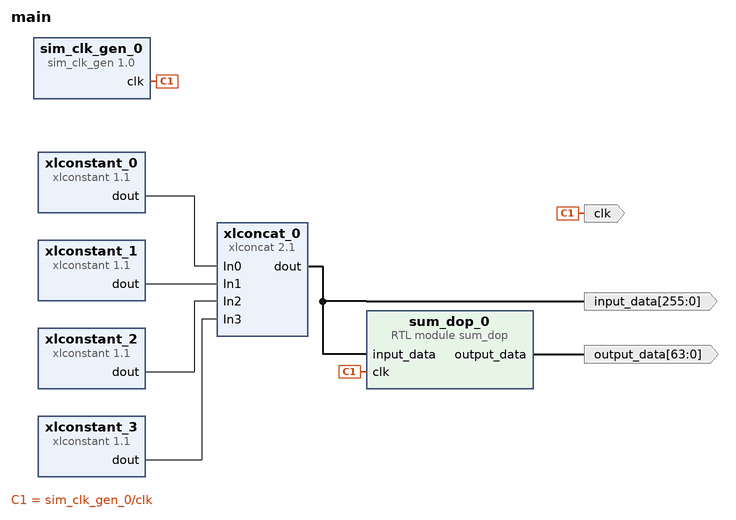
[diagram p0: block diagram of the top level]
# Vivado block design main, xczu48dr-fsvg1517-2-e-es1, Vivado 2020.2
create_bd_design main

create_bd_port -dir O -from 63 -to 0 output_data
create_bd_port -dir O clk
create_bd_port -dir O -from 255 -to 0 input_data

create_bd_cell -type module -reference sum_dop sum_dop_0
create_bd_cell -type ip -vlnv xilinx.com:ip:sim_clk_gen:1.0 sim_clk_gen_0
create_bd_cell -type ip -vlnv xilinx.com:ip:xlconcat:2.1 xlconcat_0
set_property -dict {CONFIG.NUM_PORTS 4} [get_bd_cells xlconcat_0]
create_bd_cell -type ip -vlnv xilinx.com:ip:xlconstant:1.1 xlconstant_0
set_property -dict {CONFIG.CONST_VAL 1 CONFIG.CONST_WIDTH 64} [get_bd_cells xlconstant_0]
create_bd_cell -type ip -vlnv xilinx.com:ip:xlconstant:1.1 xlconstant_1
set_property -dict {CONFIG.CONST_VAL 2 CONFIG.CONST_WIDTH 64} [get_bd_cells xlconstant_1]
create_bd_cell -type ip -vlnv xilinx.com:ip:xlconstant:1.1 xlconstant_2
set_property -dict {CONFIG.CONST_VAL 3 CONFIG.CONST_WIDTH 64} [get_bd_cells xlconstant_2]
create_bd_cell -type ip -vlnv xilinx.com:ip:xlconstant:1.1 xlconstant_3
set_property -dict {CONFIG.CONST_VAL 4 CONFIG.CONST_WIDTH 64} [get_bd_cells xlconstant_3]

# ---- connections ----

connect_bd_net [get_bd_pins sim_clk_gen_0/clk] [get_bd_pins sum_dop_0/clk] [get_bd_ports clk]
connect_bd_net [get_bd_pins xlconcat_0/dout] [get_bd_pins sum_dop_0/input_data] [get_bd_ports input_data]
connect_bd_net [get_bd_pins xlconstant_0/dout] [get_bd_pins xlconcat_0/In0]
connect_bd_net [get_bd_pins xlconstant_1/dout] [get_bd_pins xlconcat_0/In1]
connect_bd_net [get_bd_pins xlconstant_2/dout] [get_bd_pins xlconcat_0/In2]
connect_bd_net [get_bd_pins xlconstant_3/dout] [get_bd_pins xlconcat_0/In3]
connect_bd_net [get_bd_pins sum_dop_0/output_data] [get_bd_ports output_data]

validate_bd_design
save_bd_design
